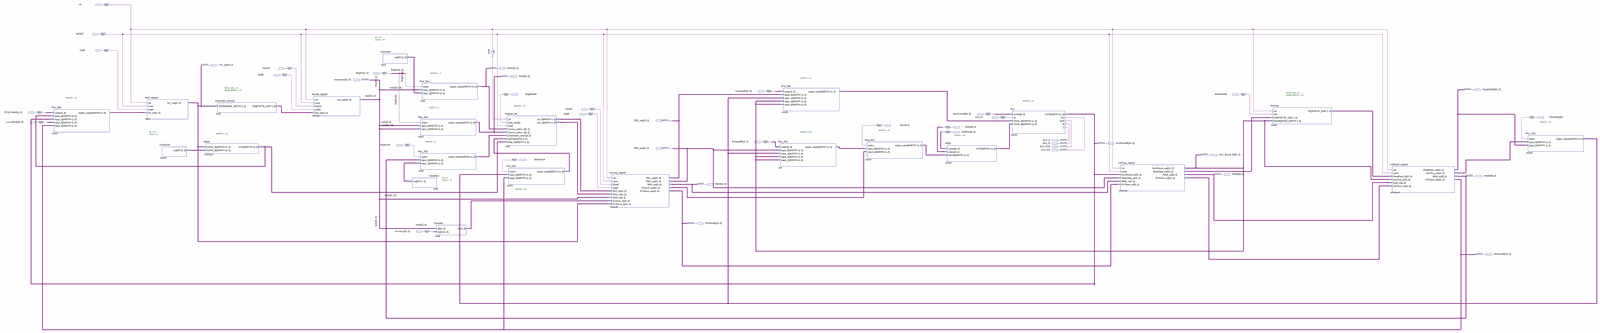
[diagram p0: schematic sheet, whole]
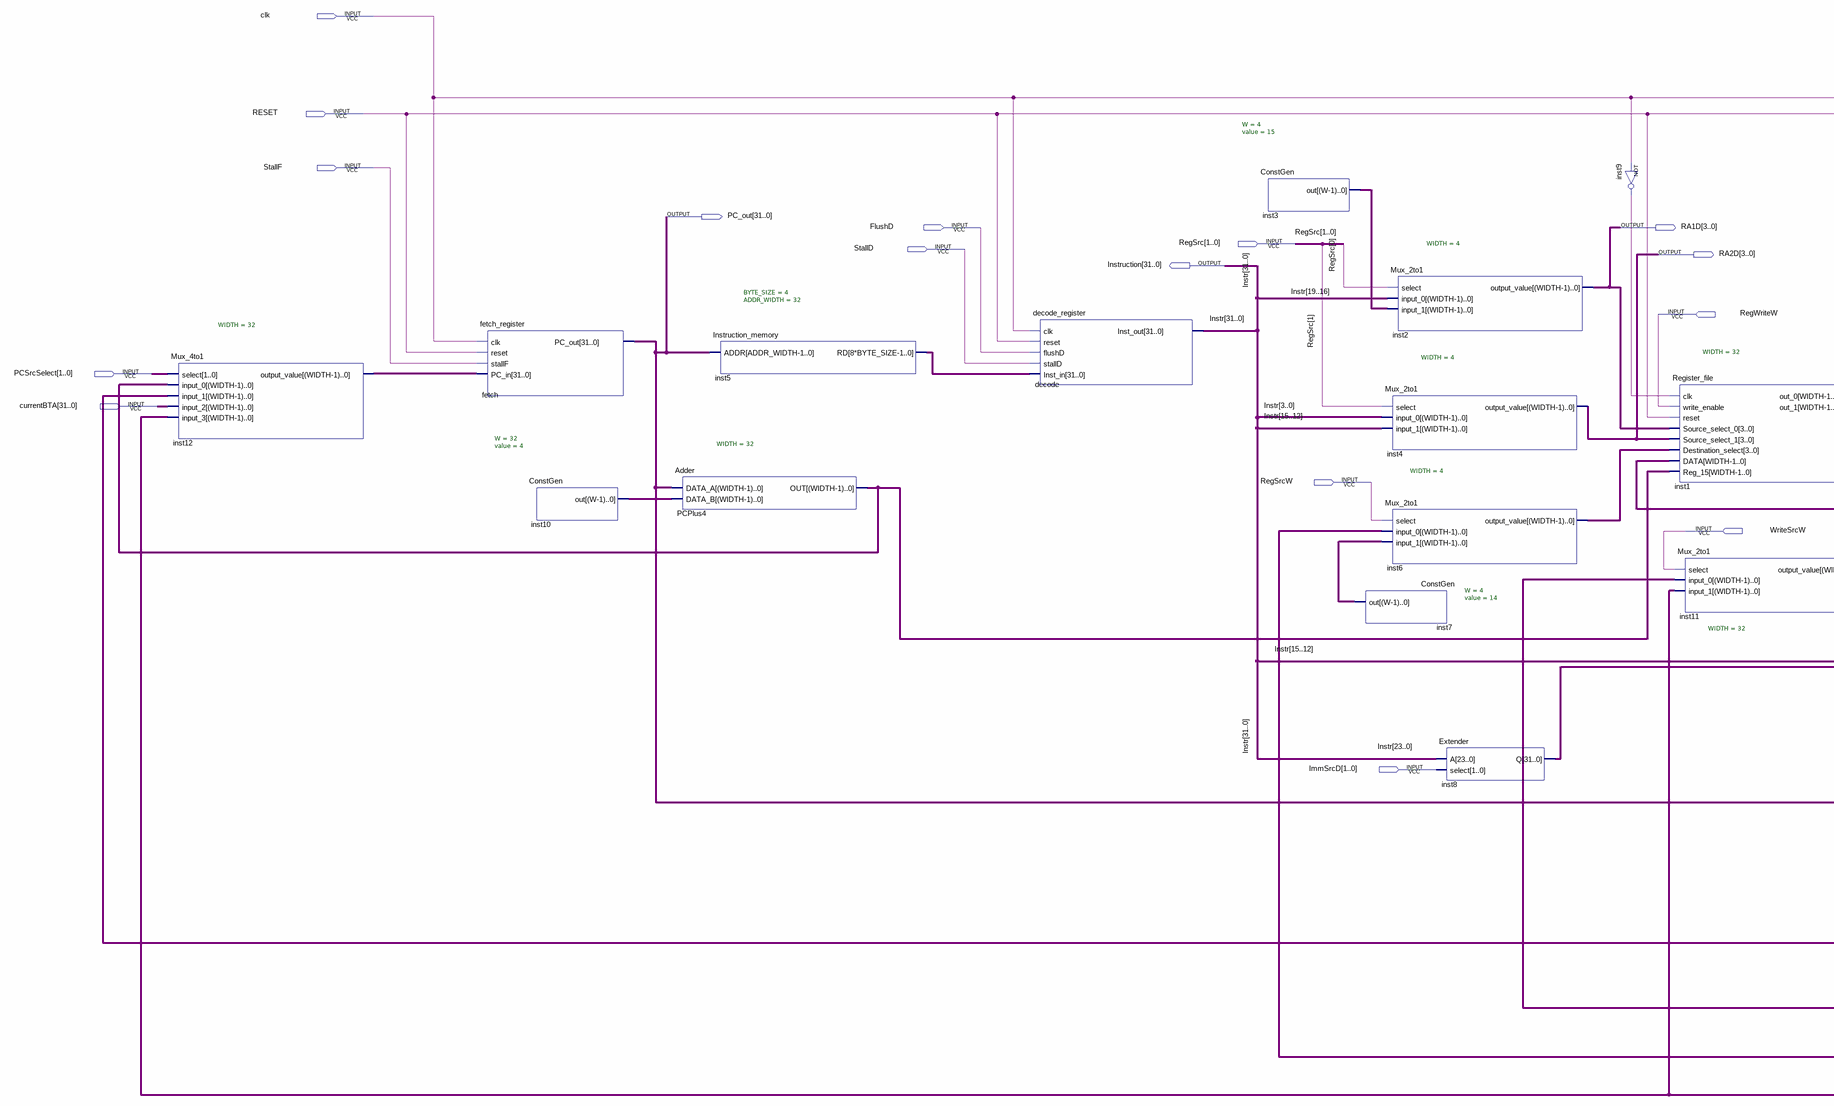
[diagram p1: schematic sheet, left part]
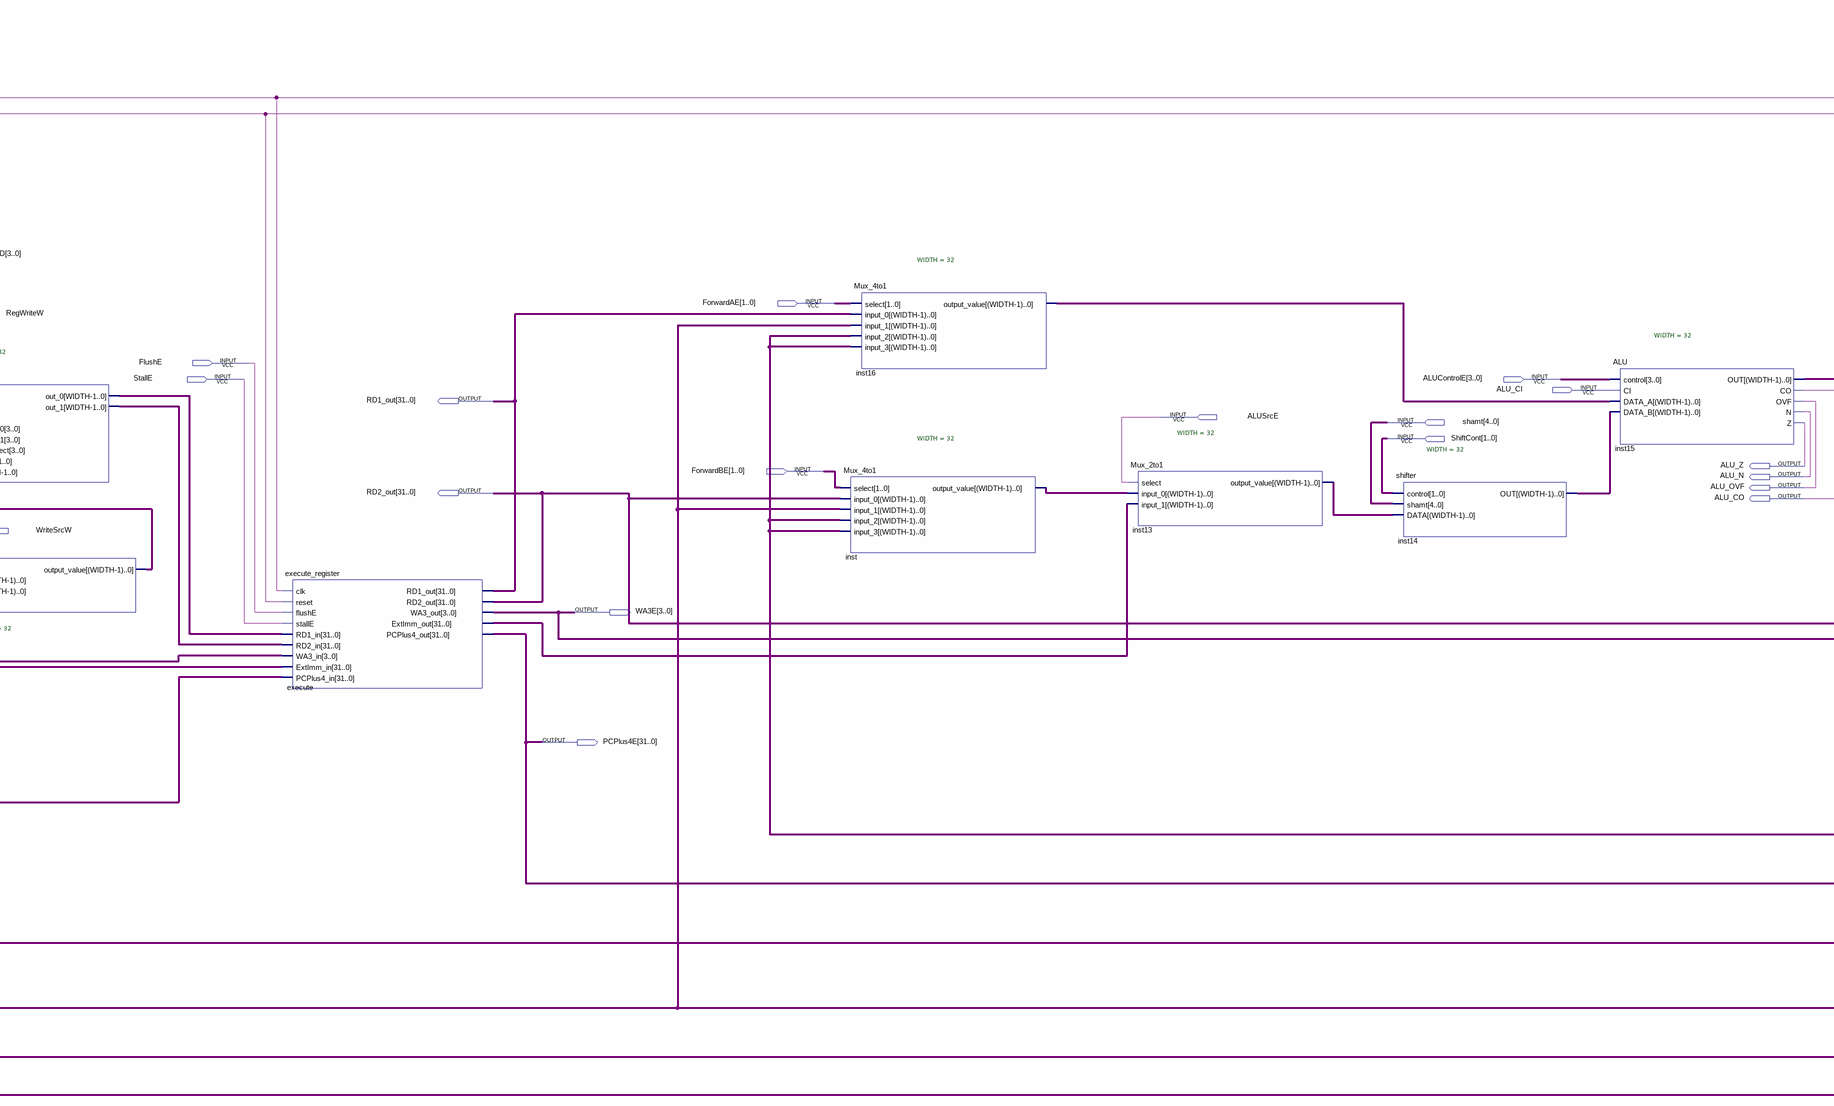
[diagram p2: schematic sheet, centre part]
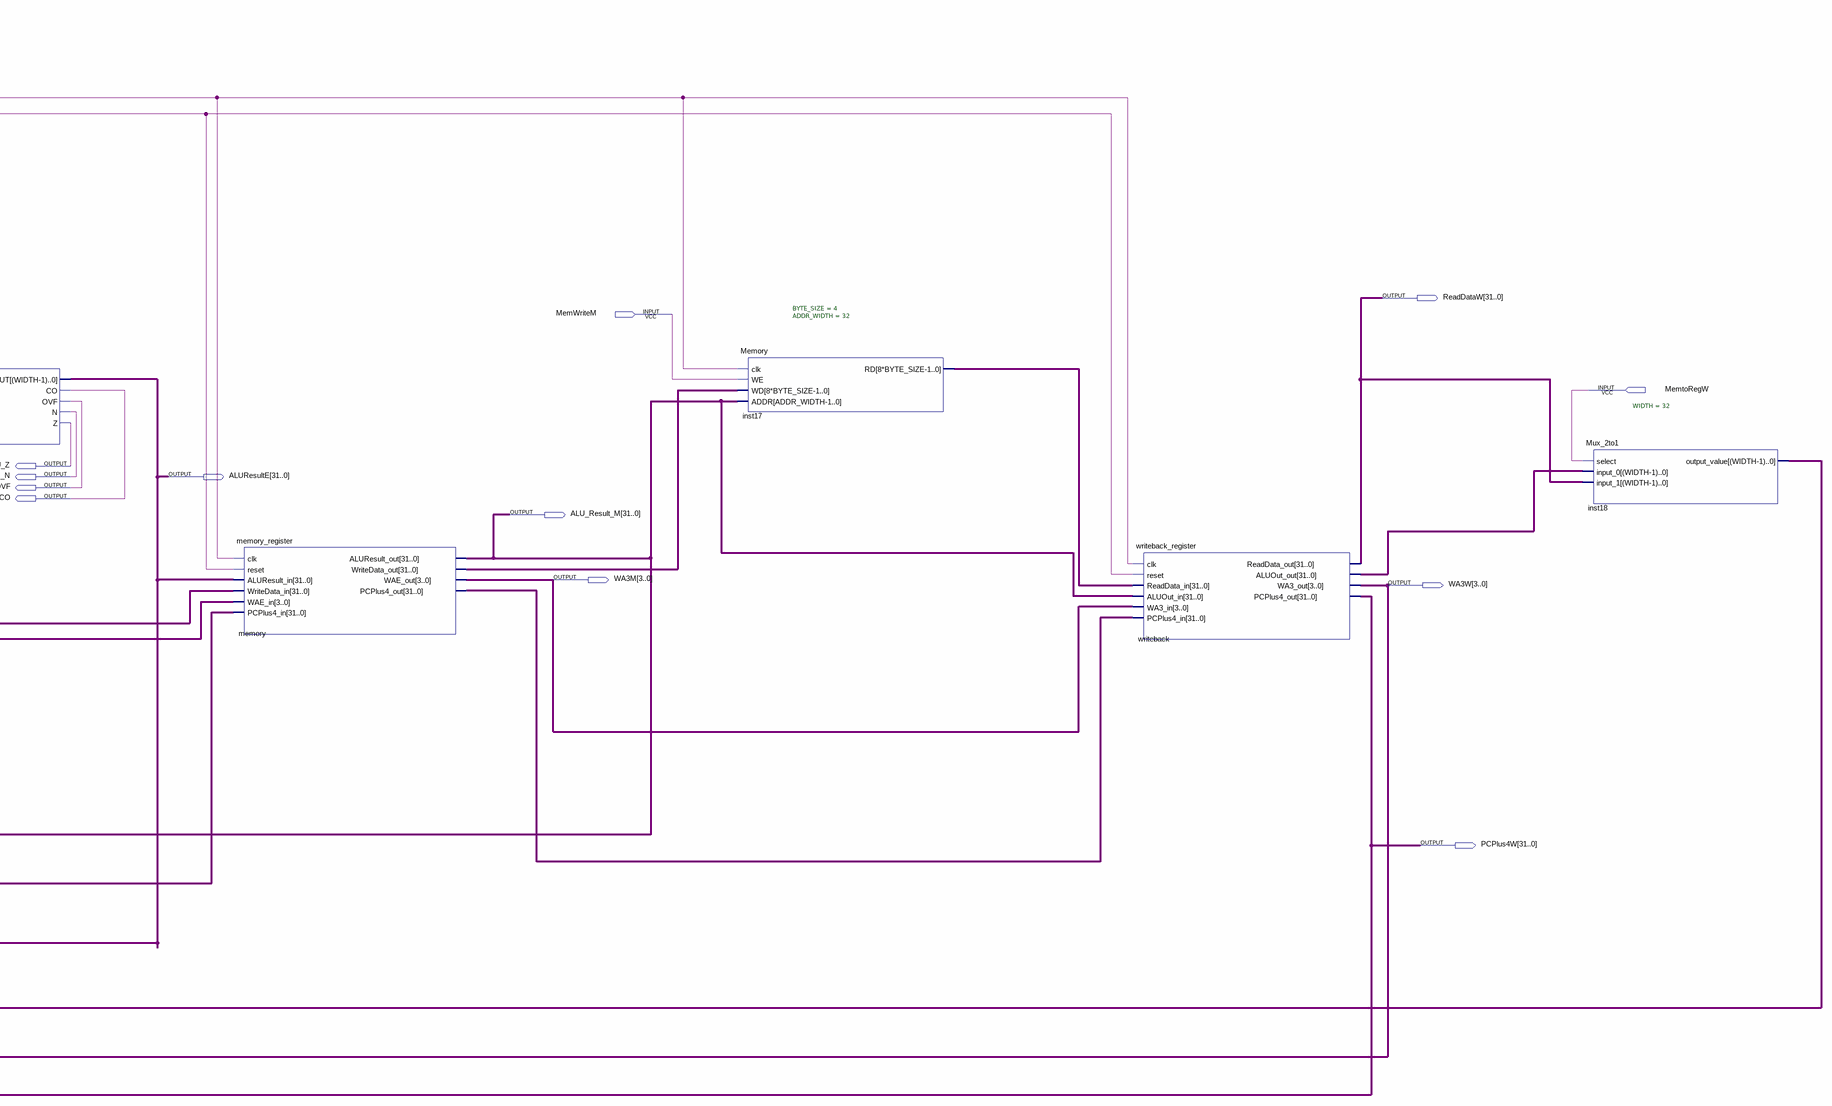
[diagram p3: schematic sheet, right part]
// Quartus schematic datapath.bdf as structural Verilog: 25 symbols, 41 pins
module datapath (
  input  clk,
  input  RESET,
  input  StallF,
  input  FlushD,
  input  [1:0] RegSrc,
  input  StallD,
  input  [1:0] ForwardAE,
  input  RegWriteW,
  input  MemWriteM,
  input  FlushE,
  input  [1:0] PCSrcSelect,
  input  StallE,
  input  [3:0] ALUControlE,
  input  ALU_CI,
  input  MemtoRegW,
  input  [31:0] currentBTA,
  input  ALUSrcE,
  input  [4:0] shamt,
  input  [1:0] ShiftCont,
  input  [1:0] ForwardBE,
  input  RegSrcW,
  input  WriteSrcW,
  input  [1:0] ImmSrcD,
  output [31:0] PC_out,
  output [3:0] RA1D,
  output [3:0] RA2D,
  output [31:0] Instruction,
  output [31:0] ReadDataW,
  output [31:0] RD1_out,
  output ALU_Z,
  output ALU_N,
  output [31:0] ALUResultE,
  output ALU_OVF,
  output [31:0] RD2_out,
  output ALU_CO,
  output [31:0] ALU_Result_M,
  output [3:0] WA3M,
  output [3:0] WA3W,
  output [3:0] WA3E,
  output [31:0] PCPlus4E,
  output [31:0] PCPlus4W
);

  wire inst9_out;
  wire [3:0] inst3_out, inst6_output_value, inst7_out;
  wire [31:0] execute_extimm_out, inst1_out_0, inst1_out_1, inst5_rd, inst8_q, inst10_out,
       inst11_output_value, inst12_output_value, inst13_output_value, inst14_out, inst16_output_value,
       inst17_rd, inst18_output_value, inst_output_value, memory_pcplus4_out, memory_writedata_out,
       PCPlus4_out, writeback_aluout_out;

  Mux_4to1 #(.WIDTH(32)) inst12 (
    .select(PCSrcSelect), .input_0(PCPlus4_out), .input_1(ALUResultE), .input_2(currentBTA),
    .input_3(PCPlus4W), .output_value(inst12_output_value));
  fetch_register fetch (.clk(clk), .reset(RESET), .stallF(StallF), .PC_in(inst12_output_value), .PC_out(PC_out));
  ConstGen #(.W(32), .value(4)) inst10 (.out(inst10_out));
  Adder #(.WIDTH(32)) PCPlus4 (.DATA_A(PC_out), .DATA_B(inst10_out), .OUT(PCPlus4_out));
  Instruction_memory #(.BYTE_SIZE(4), .ADDR_WIDTH(32)) inst5 (.ADDR(PC_out), .RD(inst5_rd));
  decode_register decode (
    .clk(clk), .reset(RESET), .flushD(FlushD), .stallD(StallD), .Inst_in(inst5_rd), .Inst_out(Instruction));
  ConstGen #(.W(4), .value(15)) inst3 (.out(inst3_out));
  ConstGen #(.W(4), .value(14)) inst7 (.out(inst7_out));
  Mux_2to1 #(.WIDTH(4)) inst2 (
    .select(RegSrc[0]), .input_0(Instruction[19:16]), .input_1(inst3_out), .output_value(RA1D));
  Mux_2to1 #(.WIDTH(4)) inst4 (
    .select(RegSrc[1]), .input_0(Instruction[3:0]), .input_1(Instruction[15:12]), .output_value(RA2D));
  Mux_2to1 #(.WIDTH(4)) inst6 (
    .select(RegSrcW), .input_0(WA3W), .input_1(inst7_out), .output_value(inst6_output_value));
  Extender inst8 (.A(Instruction[23:0]), .select(ImmSrcD), .Q(inst8_q));
  not inst9 (inst9_out, clk);
  Register_file #(.WIDTH(32)) inst1 (
    .clk(inst9_out), .write_enable(RegWriteW), .reset(RESET), .Source_select_0(RA1D), .Source_select_1(RA2D),
    .Destination_select(inst6_output_value), .DATA(inst11_output_value), .Reg_15(PCPlus4_out),
    .out_0(inst1_out_0), .out_1(inst1_out_1));
  Mux_2to1 #(.WIDTH(32)) inst11 (
    .select(WriteSrcW), .input_0(inst18_output_value), .input_1(PCPlus4W), .output_value(inst11_output_value));
  execute_register execute (
    .clk(clk), .reset(RESET), .flushE(FlushE), .stallE(StallE), .RD1_in(inst1_out_0), .RD2_in(inst1_out_1),
    .WA3_in(Instruction[15:12]), .ExtImm_in(inst8_q), .PCPlus4_in(PC_out), .RD1_out(RD1_out),
    .RD2_out(RD2_out), .WA3_out(WA3E), .ExtImm_out(execute_extimm_out), .PCPlus4_out(PCPlus4E));
  Mux_4to1 #(.WIDTH(32)) inst16 (
    .select(ForwardAE), .input_0(RD1_out), .input_1(inst18_output_value), .input_2(ALU_Result_M),
    .input_3(ALU_Result_M), .output_value(inst16_output_value));
  Mux_4to1 #(.WIDTH(32)) inst (
    .select(ForwardBE), .input_0(RD2_out), .input_1(inst18_output_value), .input_2(ALU_Result_M),
    .input_3(ALU_Result_M), .output_value(inst_output_value));
  Mux_2to1 #(.WIDTH(32)) inst13 (
    .select(ALUSrcE), .input_0(inst_output_value), .input_1(execute_extimm_out),
    .output_value(inst13_output_value));
  shifter #(.WIDTH(32)) inst14 (.control(ShiftCont), .shamt(shamt), .DATA(inst13_output_value), .OUT(inst14_out));
  ALU #(.WIDTH(32)) inst15 (
    .control(ALUControlE), .CI(ALU_CI), .DATA_A(inst16_output_value), .DATA_B(inst14_out), .OUT(ALUResultE),
    .CO(ALU_CO), .OVF(ALU_OVF), .N(ALU_N), .Z(ALU_Z));
  memory_register memory (
    .clk(clk), .reset(RESET), .ALUResult_in(ALUResultE), .WriteData_in(RD2_out), .WAE_in(WA3E),
    .PCPlus4_in(PCPlus4E), .ALUResult_out(ALU_Result_M), .WriteData_out(memory_writedata_out),
    .WAE_out(WA3M), .PCPlus4_out(memory_pcplus4_out));
  Memory #(.BYTE_SIZE(4), .ADDR_WIDTH(32)) inst17 (
    .clk(clk), .WE(MemWriteM), .WD(memory_writedata_out), .ADDR(ALU_Result_M), .RD(inst17_rd));
  writeback_register writeback (
    .clk(clk), .reset(RESET), .ReadData_in(inst17_rd), .ALUOut_in(ALU_Result_M), .WA3_in(WA3M),
    .PCPlus4_in(memory_pcplus4_out), .ReadData_out(ReadDataW), .ALUOut_out(writeback_aluout_out),
    .WA3_out(WA3W), .PCPlus4_out(PCPlus4W));
  Mux_2to1 #(.WIDTH(32)) inst18 (
    .select(MemtoRegW), .input_0(writeback_aluout_out), .input_1(ReadDataW),
    .output_value(inst18_output_value));

  // Other names for the same wires on the sheet: Instr[31:0] = Instruction
endmodule
